# Altium schematic sheet LG_TRACKER_IO_Expanders.SchDoc
size B; SheetNumber: 6; SheetTotal: 17
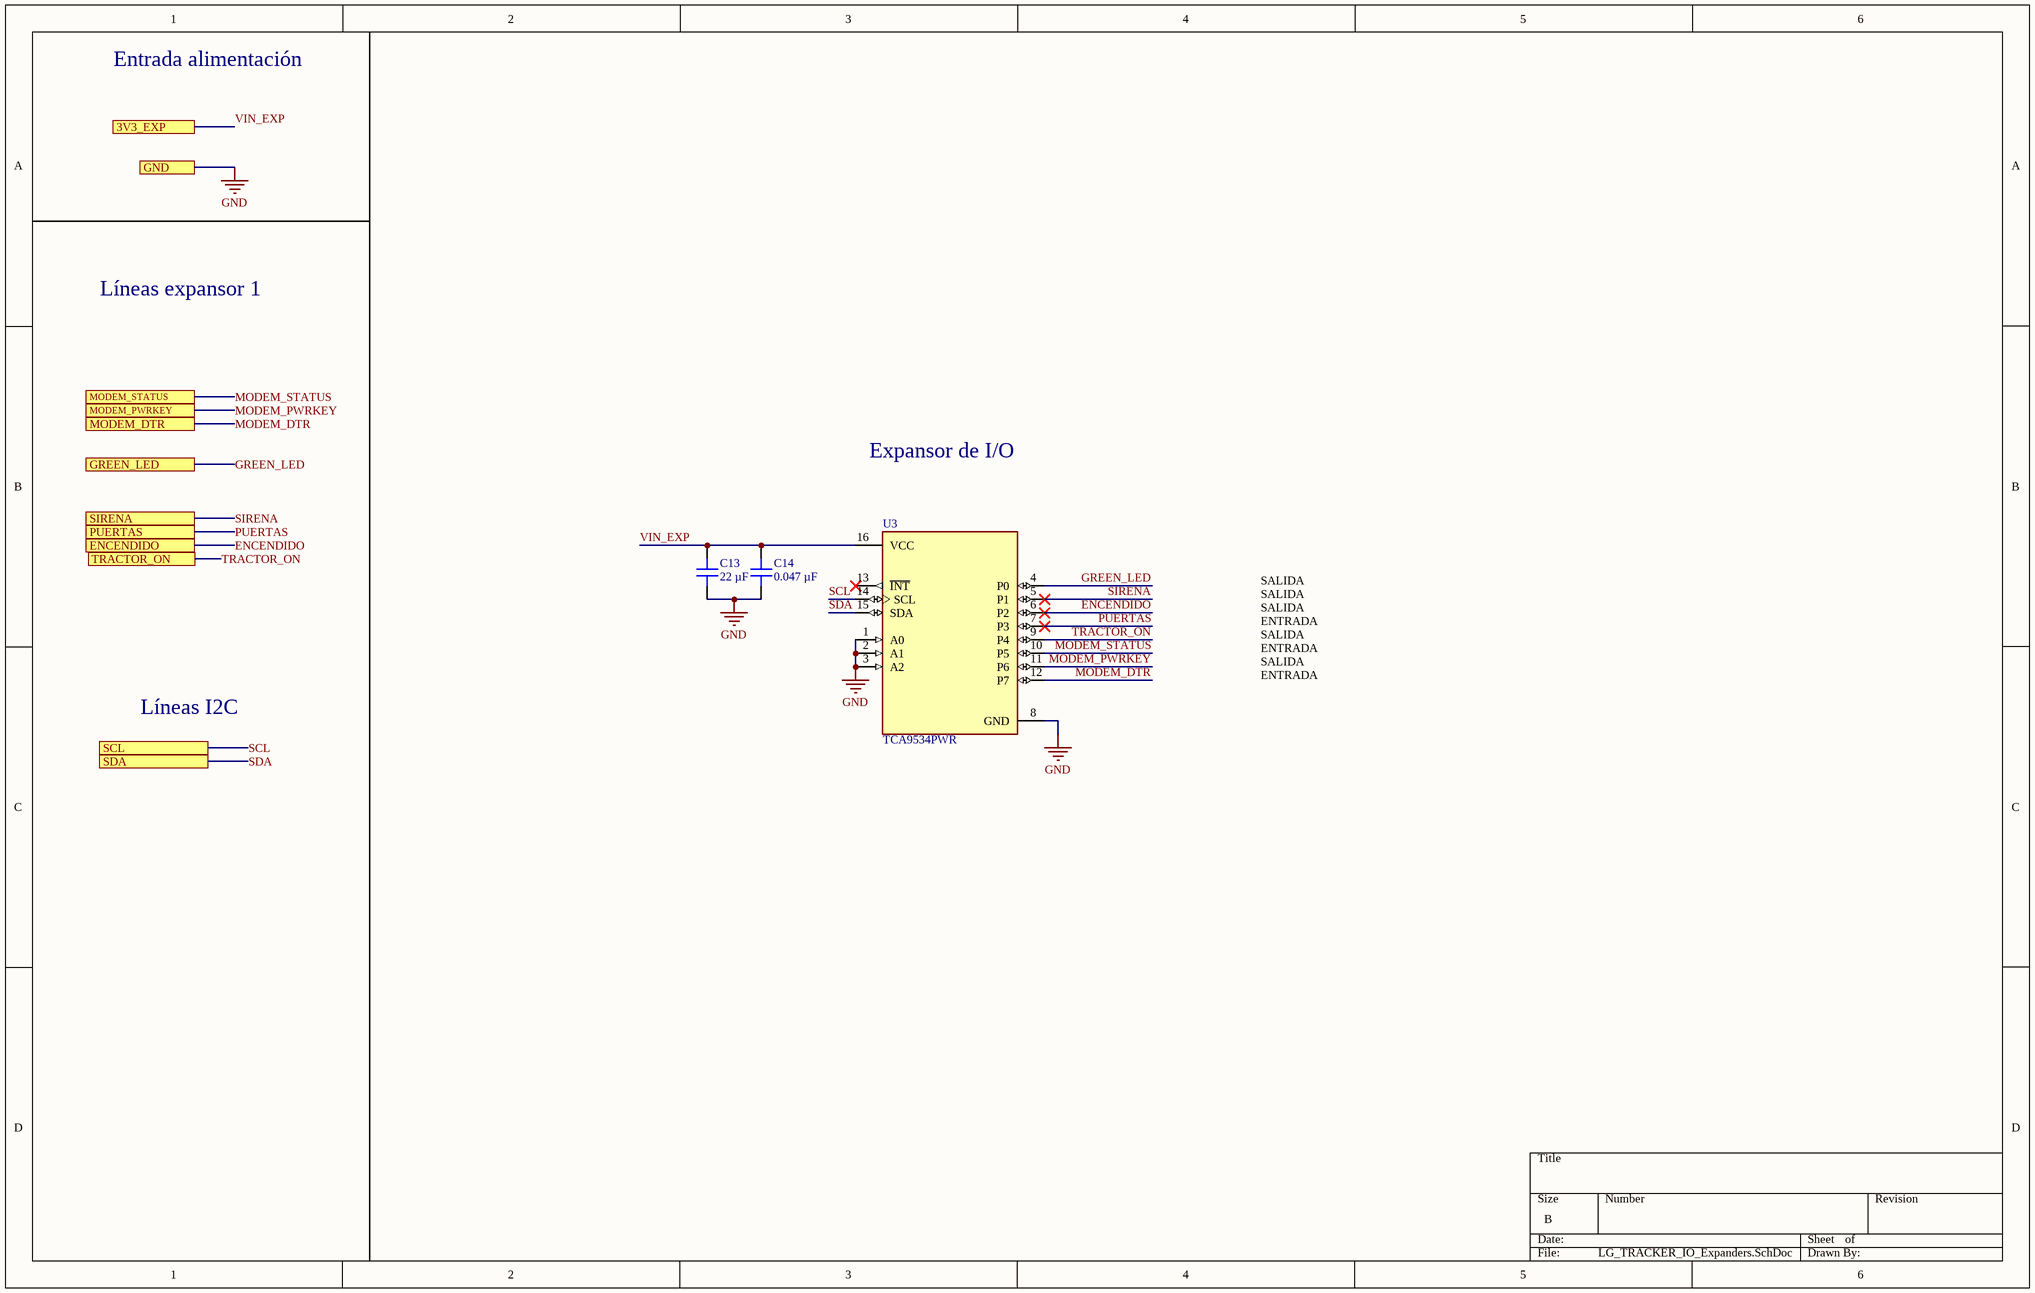
[diagram p0: LG_TRACKER_IO_Expanders.SchDoc]

## Parts
C13  22 µF  [CAP 0805_2012]
C14  0.047 µF  [CAP 0603_1608]
U3  TCA9534PWR  [16-TSSOP]

## Ports
3V3_EXP, ENCENDIDO, GND, GREEN_LED, MODEM_DTR, MODEM_PWRKEY, MODEM_STATUS, PUERTAS, SCL, SDA, SIRENA, TRACTOR_ON

## Nets
GND: C13.1 C14.1 U3.1(A0) U3.2(A1) U3.3(A2) U3.8(GND) ; port GND
ENCENDIDO: U3.6(P2) ; port ENCENDIDO
GREEN_LED: U3.4(P0) ; port GREEN_LED
MODEM_DTR: U3.12(P7) ; port MODEM_DTR
MODEM_PWRKEY: U3.11(P6) ; port MODEM_PWRKEY
MODEM_STATUS: U3.10(P5) ; port MODEM_STATUS
PUERTAS: U3.7(P3) ; port PUERTAS
SCL: U3.14(SCL) ; port SCL
SDA: U3.15(SDA) ; port SDA
SIRENA: U3.5(P1) ; port SIRENA
TRACTOR_ON: U3.9(P4) ; port TRACTOR_ON
VIN_EXP: C13.2 C14.2 U3.16(VCC) ; port 3V3_EXP

Not connected (* = marked no-connect by the designer): U3 13(~{INT})*

## Notes on the sheet
- Entrada alimentación
- Líneas expansor 1
- Expansor de I/O
- Líneas I2C
- SALIDA                                  SALIDA                      SALIDA                       ENTRADA                             SALIDA                              ENTRADA                                      SALIDA                                                                                                                      ENTRADA

## Library data of the parts
C13 = CL21A226MOCLRNC: CAP CER 22UF 16V X5R 0805; manufacturer: Samsung Electro-Mechanics; Tolerance: ±20%; Part Number: CL21A226MOCLRNC; Value: 22 µF; Applications: General Purpose; Capacitance: 22 µF; componentlink1description: Datasheet; componentlink1url: http://www.samsungsem.com/kr/support/product-search/mlcc/CL21A226MOCLRNC.jsp; componentlink2description: DigiKey Link; componentlink2url: https://www.digikey.com/en/products/detail/samsung-electro-mechanics/CL21A226MOCLRNC/5961264; Device Package: 0805 (2012 Metric); Features: Low Profile; lastupdated: 10/30/2023 7:14:19 PM; Lifecycle Status: Active; Minimum Order: 1; Mounting Type: Surface Mount, MLCC; Operating Temperature: -55°C ~ 85°C; Package / Case: 0805 (2012 Metric); packaging: TapeAndReel; partid: 4767; Part Status: Active; price: 0.05; series: CL; Size / Dimension: 0.079" L x 0.049" W (2.00mm x 1.25mm); Supplier 1: DigiKey; Supplier Part Number 1: 1276-6780-1-ND; Temperature Coefficient: X5R; Thickness (Max): 0.037" (0.95mm); Voltage - Rated: 16V
C14 = 885012206118: CAP CER 0.047UF 100V X7R 0603; manufacturer: Würth Elektronik; Tolerance: ±10%; Part Number: 885012206118; Value: 0.047 µF; Applications: General Purpose; Capacitance: 0.047 µF; componentlink1description: Datasheet; componentlink1url: https://katalog.we-online.de/pbs/datasheet/885012206118.pdf; componentlink2description: DigiKey Link; componentlink2url: https://www.digikey.com/en/products/detail/würth-elektronik/885012206118/9346004; Device Package: 0603 (1608 Metric); lastupdated: 10/29/2023 7:09:06 PM; Lifecycle Status: Active; Minimum Order: 1; Mounting Type: Surface Mount, MLCC; Operating Temperature: -55°C ~ 125°C; Package / Case: 0603 (1608 Metric); packaging: TapeAndReel; partid: 11891; Part Status: Active; price: 0.06; series: WCAP-CSGP; Size / Dimension: 0.063" L x 0.031" W (1.60mm x 0.80mm); Supplier 1: DigiKey; Supplier Part Number 1: 732-12192-1-ND; Temperature Coefficient: X7R; Thickness (Max): 0.037" (0.95mm); Voltage - Rated: 100V
U3 = TCA9534PWR: Remote 8-Bit I2C Low-Power I/O Expander With Interrupt Output and Configuration Registers 16-TSSOP -40 to 85; Price: None; MP: TCA9534PWR; Availability: Unavailable; Package: None; Value: *